# Altium schematic sheet resolver_ad2s1200.SchDoc
size C
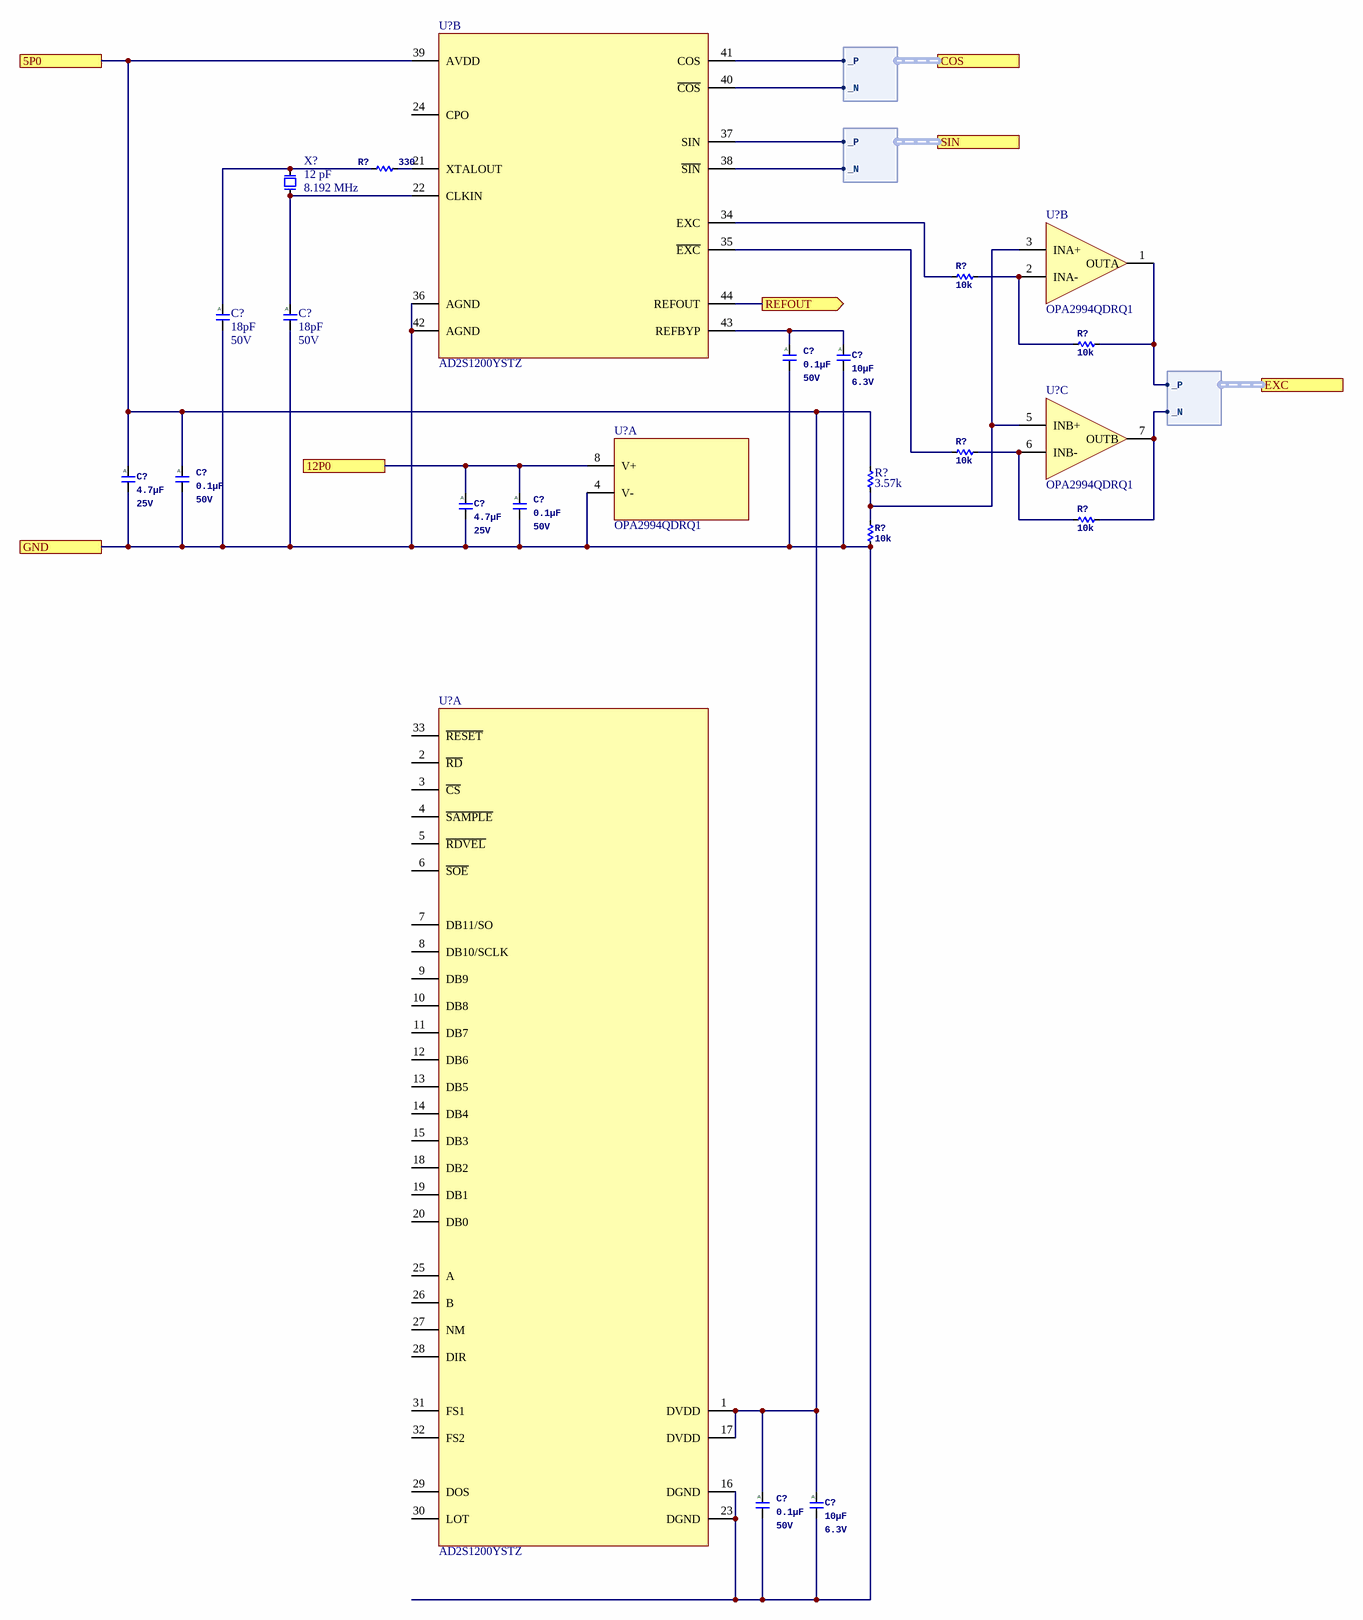
[diagram p0: resolver_ad2s1200.SchDoc]

## Parts
(Parts that share a designator on the sheet are numbered #1, #2 ... from top to bottom, then left to right.)
C?#1  Capacitance: 18pF  Voltage - Rated: 50V  [C0402_0.55MM]  (hidden comment: CGA2B2C0G1H180J050BA)
C?#2  Capacitance: 18pF  Voltage - Rated: 50V  [C0402_0.55MM]  (hidden comment: CGA2B2C0G1H180J050BA)
C?#3  Capacitance: 0.1µF  Voltage - Rated: 50V  [C0402_0.55MM]  (hidden comment: CGA2B3X7R1H104M050BB)
C?#4  Capacitance: 10µF  Voltage - Rated: 6.3V  [C0805_1.45MM]  (hidden comment: CGA4J1X7R0J106M125AC)
C?#5  Capacitance: 4.7µF  Voltage - Rated: 25V  [C0805_1.45MM]  (hidden comment: CGA4J1X7R1E475K125AC)
C?#6  Capacitance: 0.1µF  Voltage - Rated: 50V  [C0402_0.55MM]  (hidden comment: CGA2B3X7R1H104M050BB)
C?#7  Capacitance: 4.7µF  Voltage - Rated: 25V  [C0805_1.45MM]  (hidden comment: CGA4J1X7R1E475K125AC)
C?#8  Capacitance: 0.1µF  Voltage - Rated: 50V  [C0402_0.55MM]  (hidden comment: CGA2B3X7R1H104M050BB)
C?#9  Capacitance: 0.1µF  Voltage - Rated: 50V  [C0402_0.55MM]  (hidden comment: CGA2B3X7R1H104M050BB)
C?#10  Capacitance: 10µF  Voltage - Rated: 6.3V  [C0805_1.45MM]  (hidden comment: CGA4J1X7R0J106M125AC)
R?#1  Resistance: 330  [R0402_0.40MM]  (hidden comment: ERJ-PA2F3300X)
R?#2  Resistance: 10k  [R0402_0.40MM]  (hidden comment: ERJ-2RKF1002X)
R?#3  Resistance: 10k  [R0402_0.40MM]  (hidden comment: ERJ-2RKF1002X)
R?#4  Resistance: 10k  [R0402_0.40MM]  (hidden comment: ERJ-2RKF1002X)
R?#5  Resistance: 3.57k  [R0402_0.40MM]  (hidden comment: ERJ-2RKF3571X)
R?#6  Resistance: 10k  [R0402_0.40MM]  (hidden comment: ERJ-2RKF1002X)
R?#7  Resistance: 10k  [R0402_0.40MM]  (hidden comment: ERJ-2RKF1002X)
U?#1  AD2S1200YSTZ  [44LQFP10]  (part B of 2)
U?#2  OPA2994QDRQ1  [8SOIC150]  (part B of 3)
U?#3  OPA2994QDRQ1  [8SOIC150]  (part C of 3)
U?#4  OPA2994QDRQ1  [8SOIC150]  (part A of 3)
U?#5  AD2S1200YSTZ  [44LQFP10]  (part A of 2)
X?  Load Capacitance: 12 pF  Frequency: 8.192 MHz  [XTAL_ECX-53Q]  (hidden comment: ECS-81.92-12-30Q-EN-TR)

## Ports
5P0, 12P0, COS (harness DIFF), EXC (harness DIFF), GND, REFOUT (out), SIN (harness DIFF)

## Harnesses
DIFF: _P, _N

## Nets
5P0: C?#5.1 C?#6.1 C?#9.1 C?#10.1 R?#5.1 U?#1.39(AVDD) U?#5.1(DVDD) U?#5.17(DVDD) ; port 5P0
12P0: C?#7.1 C?#8.1 U?#4.8(V+) ; port 12P0
GND: C?#1.2 C?#2.2 C?#3.2 C?#4.2 C?#5.2 C?#6.2 C?#7.2 C?#8.2 C?#9.2 C?#10.2 R?#6.2 U?#1.36(AGND) U?#1.42(AGND) U?#4.4(V-) U?#5.16(DGND) U?#5.23(DGND) ; port GND
REFOUT: U?#1.44(REFOUT) ; port REFOUT
NetC?#1_1: C?#1.1 R?#1.1 X?.1
NetC?#2_1: C?#2.1 U?#1.22(CLKIN) X?.2
NetC?#3_1: C?#3.1 C?#4.1 U?#1.43(REFBYP)
NetR?#1_2: R?#1.2 U?#1.21(XTALOUT)
NetR?#2_1: R?#2.1 R?#3.2 U?#2.2(INA-)
NetR?#2_2: R?#2.2 U?#1.34(EXC)
NetR?#3_1: R?#3.1 U?#2.1(OUTA) ; port EXC._P
NetR?#4_1: R?#4.1 R?#7.2 U?#3.6(INB-)
NetR?#4_2: R?#4.2 U?#1.35(~{EXC})
NetR?#5_2: R?#5.2 R?#6.1 U?#2.3(INA+) U?#3.5(INB+)
NetR?#7_1: R?#7.1 U?#3.7(OUTB) ; port EXC._N
NetU?#1_37: U?#1.37(SIN) ; port SIN._P
NetU?#1_38: U?#1.38(~{SIN}) ; port SIN._N
NetU?#1_40: U?#1.40(~{COS}) ; port COS._N
NetU?#1_41: U?#1.41(COS) ; port COS._P

Not connected (* = marked no-connect by the designer): U?#1 24(CPO); U?#5 2(~{RD}) 3(~{CS}) 4(~{SAMPLE}) 5(~{RDVEL}) 6(~{SOE}) 7(DB11/SO) 8(DB10/SCLK) 9(DB9) 10(DB8) 11(DB7) 12(DB6) 13(DB5) 14(DB4) 15(DB3) 18(DB2) 19(DB1) 20(DB0) 25(A) 26(B) 27(NM) 28(DIR) 29(DOS) 30(LOT) 31(FS1) 32(FS2) 33(~{RESET})

## Notes on the sheet
- (in symbol CGA2B2C0G1H180J050BA) A
- (in symbol CGA2B3X7R1H104M050BB) A
- (in symbol CGA4J1X7R0J106M125AC) A
- (in symbol CGA4J1X7R1E475K125AC) A

## Library data of the parts
C?#1 C?#2 = CGA2B2C0G1H180J050BA: CAP CER 18PF 50V C0G 0402; Manufacturer: TDK Corporation; Unit Price (USD): 0.1; Tolerance: ±5%; Temperature Coefficient: C0G, NP0; ComponentLink1URL: https://product.tdk.com/info/en/catalog/datasheets/mlcc_automotive_general_en.pdf?ref_disty=digikey; ComponentLink1Description: Series Datasheet; Supplier 1: Digikey; Supplier Part Number 1: 445-5587-1-ND; Series: CGA; Part Status: Active; Operating Temperature: -55°C ~ 125°C; Applications: AEC-Q200; Mounting Type: Surface Mount, MLCC; Package / Case: 0402 (1005 Metric); Size / Dimension: 0.039" L x 0.020" W (1.00mm x 0.50mm); Thickness (Max): 0.022" (0.55mm); Manufacturer Part Number: CGA2B2C0G1H180J050BA
C?#3 C?#6 C?#8 C?#9 = CGA2B3X7R1H104M050BB: CAP CER 0.1UF 50V X7R 0402; Manufacturer: TDK Corporation; Unit Price (USD): 0.17; Tolerance: ±20%; ComponentLink1URL: https://product.tdk.com/info/en/catalog/datasheets/mlcc_automotive_general_en.pdf?ref_disty=digikey; ComponentLink1Description: Series Datasheet; Series: CGA; Part Status: Active; Temperature Coefficient: X7R; Operating Temperature: -55°C ~ 125°C; Applications: AEC-Q200; Mounting Type: Surface Mount, MLCC; Package / Case: 0402 (1005 Metric); Size / Dimension: 0.039" L x 0.020" W (1.00mm x 0.50mm); Thickness (Max): 0.022" (0.55mm); Supplier 1: Digikey; Supplier Part Number 1: 445-12271-1-ND; Manufacturer Part Number: CGA2B3X7R1H104M050BB
C?#4 C?#10 = CGA4J1X7R0J106M125AC: CAP CER 10UF 6.3V X7R 0805; Manufacturer: TDK Corporation; Unit Price (USD): 0.43; Tolerance: ±20%; ComponentLink1URL: https://product.tdk.com/info/en/catalog/datasheets/mlcc_automotive_general_en.pdf?ref_disty=digikey; ComponentLink1Description: Series Datasheet; Series: CGA; Part Status: Active; Temperature Coefficient: X7R; Operating Temperature: -55°C ~ 125°C; Applications: AEC-Q200; Mounting Type: Surface Mount, MLCC; Package / Case: 0805 (2012 Metric); Size / Dimension: 0.079" L x 0.049" W (2.00mm x 1.25mm); Thickness (Max): 0.057" (1.45mm); Supplier 1: Digikey; Supplier Part Number 1: 445-12776-1-ND; Manufacturer Part Number: CGA4J1X7R0J106M125AC
C?#5 C?#7 = CGA4J1X7R1E475K125AC: CAP CER 4.7UF 25V X7R 0805; Manufacturer: TDK Corporation; Unit Price (USD): 0.56; Tolerance: ±10%; ComponentLink1URL: https://product.tdk.com/info/en/catalog/datasheets/mlcc_automotive_general_en.pdf?ref_disty=digikey; ComponentLink1Description: Series Datasheet; Series: CGA; Part Status: Active; Temperature Coefficient: X7R; Operating Temperature: -55°C ~ 125°C; Applications: AEC-Q200; Mounting Type: Surface Mount, MLCC; Package / Case: 0805 (2012 Metric); Size / Dimension: 0.079" L x 0.049" W (2.00mm x 1.25mm); Thickness (Max): 0.057" (1.45mm); Supplier 1: Digikey; Supplier Part Number 1: 445-6967-1-ND; Manufacturer Part Number: CGA4J1X7R1E475K125AC
R?#1 = ERJ-PA2F3300X: RES SMD 330 OHM 1% 1/5W 0402; Manufacturer: Panasonic Electronic Components; Unit Price (USD): 0.21; Power (Watts): 0.2W, 1/5W; Temperature Coefficient: ±100ppm/°C; ComponentLink1Description: Datasheet; ComponentLink1URL: https://industrial.panasonic.com/cdbs/www-data/pdf/RDO0000/AOA0000C331.pdf; Series: ERJ; Tolerance: ±1%; Composition: Thick Film; Features: Automotive AEC-Q200, Pulse Withstanding; Operating Temperature: -55°C ~ 155°C; Package / Case: 0402 (1005 Metric); Supplier Device Package: 0402; Size / Dimension: 0.039" L x 0.020" W (1.00mm x 0.50mm); Height - Seated (Max): 0.016" (0.40mm); Supplier 1: Digikey; Supplier Part Number 1: P17221CT-ND; Manufacturer Part Number: ERJ-PA2F3300X
R?#2-R?#4 R?#6 R?#7 = ERJ-2RKF1002X: RES SMD 10K OHM 1% 1/10W 0402; Manufacturer: Panasonic Electronic Components; Unit Price (USD): 0.1; Power (Watts): 0.1W, 1/10W; Temperature Coefficient: ±100ppm/°C; ComponentLink1Description: Datasheet; ComponentLink1URL: https://industrial.panasonic.com/cdbs/www-data/pdf/RDA0000/AOA0000C304.pdf; Series: ERJ; Tolerance: ±1%; Composition: Thick Film; Features: Automotive AEC-Q200; Operating Temperature: -55°C ~ 155°C; Package / Case: 0402 (1005 Metric); Supplier Device Package: 0402; Size / Dimension: 0.039" L x 0.020" W (1.00mm x 0.50mm); Height - Seated (Max): 0.016" (0.40mm); Supplier 1: Digikey; Supplier Part Number 1: P10.0KLCT-ND; Manufacturer Part Number: ERJ-2RKF1002X
R?#5 = ERJ-2RKF3571X: RES SMD 3.57K OHM 1% 1/10W 0402; Manufacturer: Panasonic Electronic Components; Unit Price (USD): 0.1; Power (Watts): 0.1W, 1/10W; Temperature Coefficient: ±100ppm/°C; ComponentLink1Description: Datasheet; ComponentLink1URL: https://industrial.panasonic.com/cdbs/www-data/pdf/RDA0000/AOA0000C304.pdf; Series: ERJ; Tolerance: ±1%; Composition: Thick Film; Features: Automotive AEC-Q200; Operating Temperature: -55°C ~ 155°C; Package / Case: 0402 (1005 Metric); Supplier Device Package: 0402; Size / Dimension: 0.039" L x 0.020" W (1.00mm x 0.50mm); Height - Seated (Max): 0.016" (0.40mm); Supplier 1: Digikey; Supplier Part Number 1: P3.57KLCT-ND; Manufacturer Part Number: ERJ-2RKF3571X
U?#1 U?#5 = RESOLVER_AD2S1200YSTZ: Synchro or Resolver to Digital Converter, PQFP44; Manufacturer: Analog Devices; Supplier 1: Digikey; Supplier Part Number 1: 505-AD2S1200YSTZ-ND; Manufacturer Part Number: AD2S1200YSTZ; ComponentLink1Description: Datasheet; ComponentLink1URL: https://www.analog.com/media/en/technical-documentation/data-sheets/AD2S1200.pdf; Supplier 2: LCSC; Supplier Part Number 2: C649116
U?#2-U?#4 = OPAMP_OPA2994QDRQ1: Automotive, dual, 24V 25MHz high-output-current (150 mA) operational amplifier 8-SOIC -40 to 125; Manufacturer: Texas Instruments; Supplier 1: Digikey; Supplier Part Number 1: 296-OPA2994QDRQ1CT-ND; Manufacturer Part Number: OPA2994QDRQ1; Supplier 2: LCSC; Supplier Part Number 2: C4369938; ComponentLink1Description: Datasheet; ComponentLink1URL: https://www.ti.com/lit/ds/symlink/opa2994-q1.pdf
X? = XTAL_ECS-81.92-12-30Q-EN-TR: Parallel - Fundamental Quartz Crystal, 8.192MHz Nom; Manufacturer: ECS International; Supplier 1: Digikey; Supplier Part Number 1: XC3145CT-ND; Manufacturer Part Number: ECS-81.92-12-30Q-EN-TR; Supplier 2: LCSC; Supplier Part Number 2: C2450755; ComponentLink1Description: Datasheet; ComponentLink1URL: https://ecsxtal.com/store/pdf/ECX-53Q.pdf